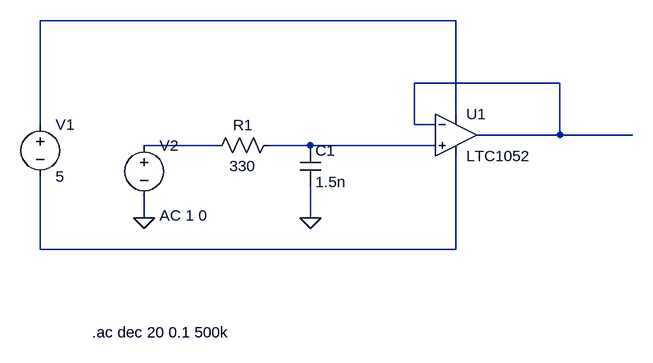
[diagram p0: schematic 300kLowPass.asc]
300kLowPass.asc, the LTspice schematic file:
Version 4
SHEET 1 880 680
WIRE 304 -64 -336 -64
WIRE 464 32 240 32
WIRE 304 80 304 -64
WIRE -336 96 -336 -64
WIRE 240 96 240 32
WIRE 272 96 240 96
WIRE 464 112 464 32
WIRE 464 112 336 112
WIRE 576 112 464 112
WIRE -64 128 -176 128
WIRE 80 128 16 128
WIRE 272 128 80 128
WIRE -176 240 -176 208
WIRE 80 240 80 192
WIRE -336 288 -336 176
WIRE 304 288 304 144
WIRE 304 288 -336 288
FLAG -176 240 0
FLAG 80 240 0
SYMBOL voltage -336 80 R0
WINDOW 123 0 0 Left 2
WINDOW 39 0 0 Left 2
SYMATTR InstName V1
SYMATTR Value 5
SYMBOL voltage -176 112 R0
WINDOW 123 24 124 Left 2
WINDOW 39 0 0 Left 2
SYMATTR Value2 AC 1 0
SYMATTR InstName V2
SYMATTR Value ""
SYMBOL Opamps\\LTC1052 304 48 R0
SYMATTR InstName U1
SYMBOL res 32 112 R90
WINDOW 0 0 56 VBottom 2
WINDOW 3 32 56 VTop 2
SYMATTR InstName R1
SYMATTR Value 330
SYMBOL cap 64 128 R0
SYMATTR InstName C1
SYMATTR Value 1.5n
TEXT -256 416 Left 2 !.ac dec 20 0.1 500k

The netlist it stands for:
* 300kLowPass.asc
V1 N001 N005 5
V2 N003 0 AC 1 0
XU1 N004 N002 N001 N005 N002 LTC1052  ; pins In+ In- V+ V- OUT
R1 N004 N003 330
C1 N004 0 1.5n
.ac dec 20 0.1 500k
.backanno
.end